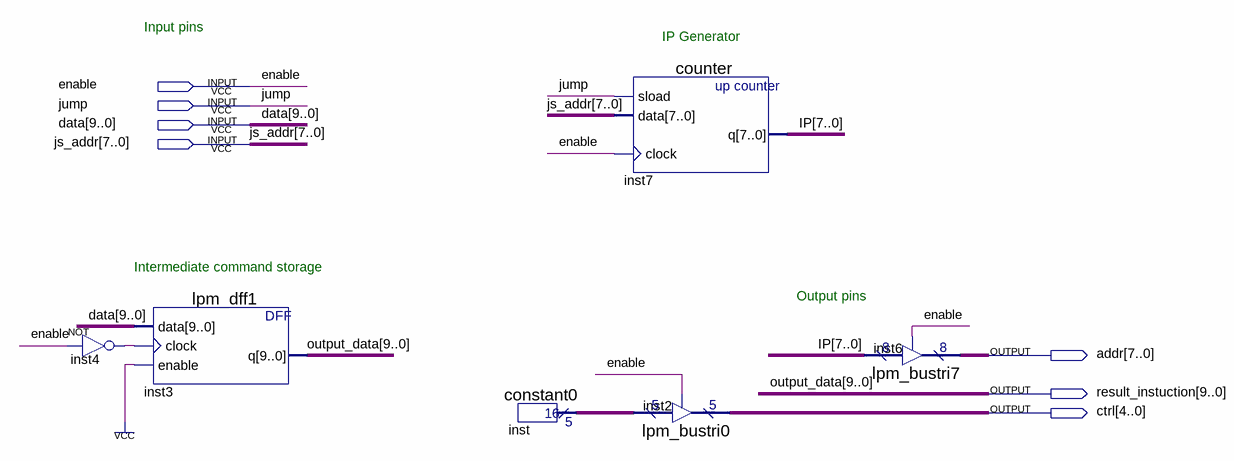
[diagram p0: schematic sheet]
// Quartus schematic CommandRetrieval.bdf as structural Verilog: 6 symbols, 7 pins
module CommandRetrieval (
  input  enable,
  input  jump,
  input  [9:0] data,
  input  [7:0] js_addr,
  output [7:0] addr,
  output [9:0] result_instuction,
  output [4:0] ctrl
);

  wire inst4_out;
  wire [4:0] inst_result;
  wire [7:0] IP;

  not inst4 (inst4_out, enable);
  lpm_dff1 inst3 (.data(data), .clock(inst4_out), .enable(1'b1), .q(result_instuction));
  constant0 inst (.result(inst_result));
  counter inst7 (.sload(jump), .data(js_addr), .clock(enable), .q(IP));
  lpm_bustri0 inst2 (.enabledt(enable), .data(inst_result), .tridata(ctrl));
  lpm_bustri7 inst6 (.enabledt(enable), .data(IP), .tridata(addr));

  // Other names for the same wires on the sheet: output_data[9:0] = result_instuction

  // Notes on the sheet:
  //   Input pins
  //   IP Generator
  //   Intermediate command storage
  //   Output pins
endmodule
